# Altium schematic sheet Supplies.SchDoc
size A4
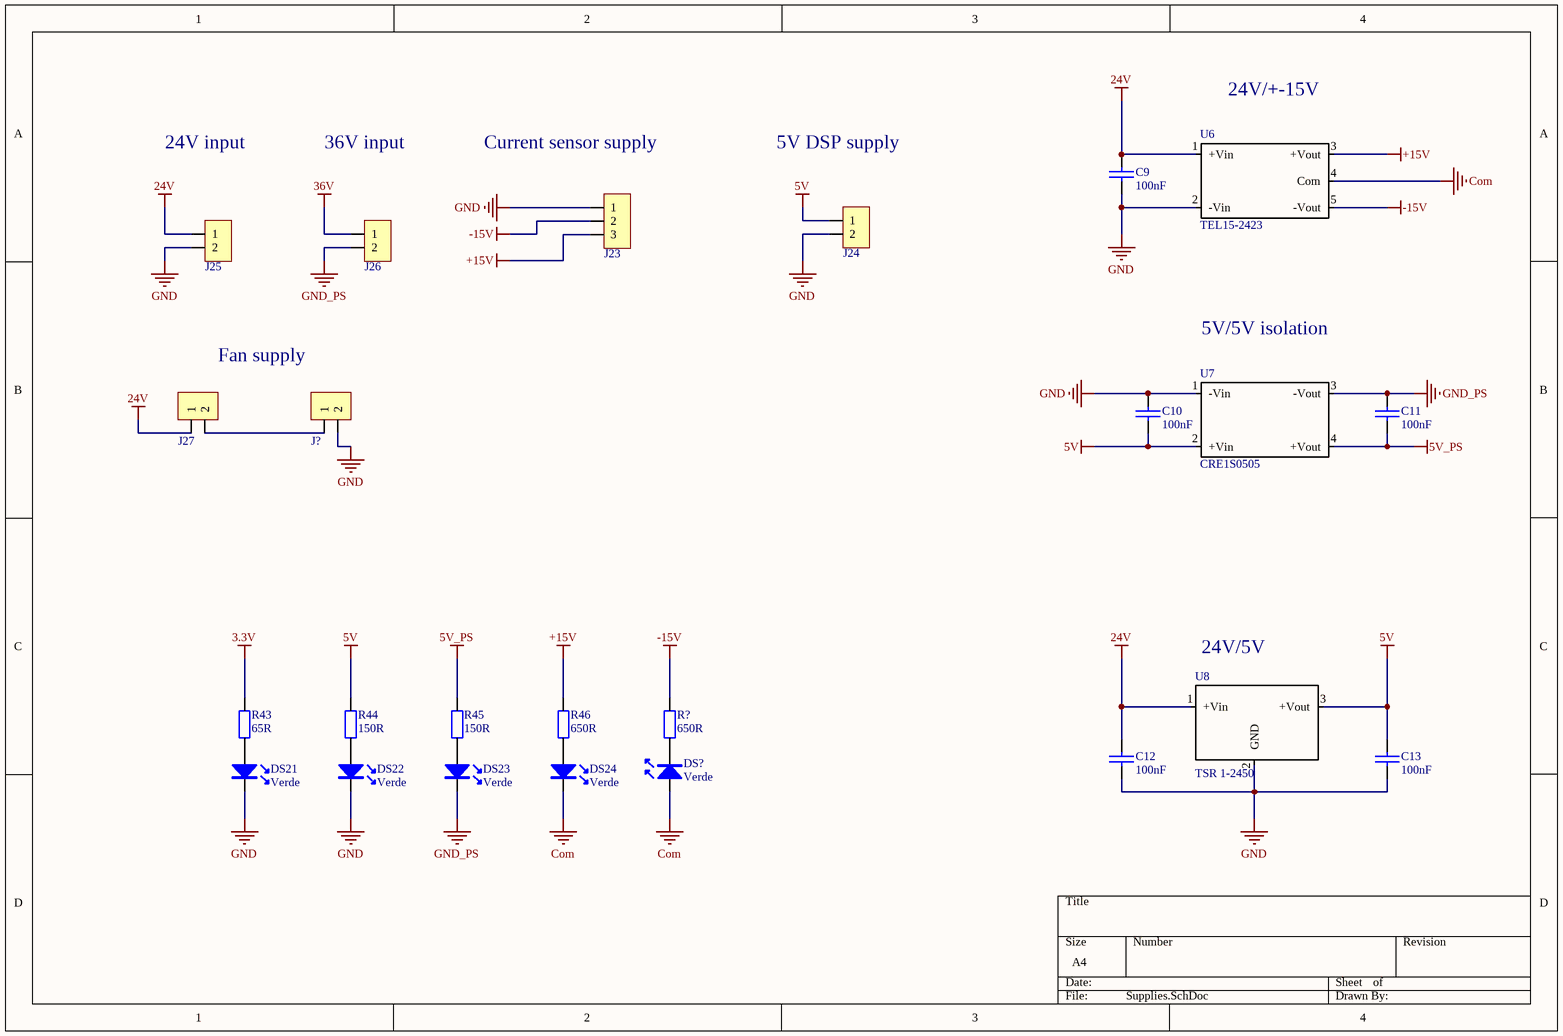
[diagram p0: Supplies.SchDoc]

## Parts
C9  100nF  [1206]
C10  100nF  [1206]
C11  100nF  [1206]
C12  100nF  [1206]
C13  100nF  [1206]
DS21  Verde  [Led 3mm]
DS22  Verde  [Led 3mm]
DS23  Verde  [Led 3mm]
DS24  Verde  [Led 3mm]
DS?  Verde  [Led 3mm]
J23  Cur_meas_con  [Con3_KK_256]  (value not drawn)
J24  Cleva 2 vias  [Clema_2_vias]  (value not drawn)
J25  Cleva 2 vias  [Con2_KK_256]  (value not drawn)
J26  Cleva 2 vias  [Con2_KK_256]  (value not drawn)
J27  Cleva 2 vias  [Con2_KK_256]  (value not drawn)
J?  Cleva 2 vias  [Con2_KK_256]  (value not drawn)
R43  65R  [1206]
R44  150R  [1206]
R45  150R  [1206]
R46  650R  [1206]
R?  650R  [1206]
U6  TEL15-2423  [TEL15-2423]
U7  CRE1S0505  [CRE1S0505SC]
U8  TSR 1-2450  [TSR 1-2450]

## Nets
3.3V: R43.1
5V: C10.2 C13.1 J24.1 R44.1 U7.2(+Vin) U8.3(+Vout)
5V_PS: C11.2 R45.1 U7.4(+Vout)
24V: C9.1 C12.1 J25.1 J27.1 U6.1(+Vin) U8.1(+Vin)
36V: J26.1
+15V: J23.3 R46.1 U6.3(+Vout)
-15V: J23.2 R?.1 U6.5(-Vout)
Com: DS24.K DS?.A U6.4(Com)
GND: C9.2 C10.1 C12.2 C13.2 DS21.K DS22.K J23.1 J24.2 J25.2 J?.2 U6.2(-Vin) U7.1(-Vin) U8.2(GND)
GND_PS: C11.1 DS23.K J26.2 U7.3(-Vout)
NetDS21_A: DS21.A R43.2
NetDS22_A: DS22.A R44.2
NetDS23_A: DS23.A R45.2
NetDS24_A: DS24.A R46.2
NetDS?_K: DS?.K R?.2
NetJ27_2: J27.2 J?.1

## Notes on the sheet
- (near U6) 24V/+-15V
- 24V input
- 36V input
- (near J23) Current sensor supply
- 5V DSP supply
- Fan supply
- 5V/5V isolation
- (near U8) 24V/5V

## Library data of the parts
C9-C13 = Condensador
DS21-DS24 DS? = Led
J23 = Con_3
J24-J27 J? = Con_2
R43-R46 R? = Resistencia: Potencia: 1/4W